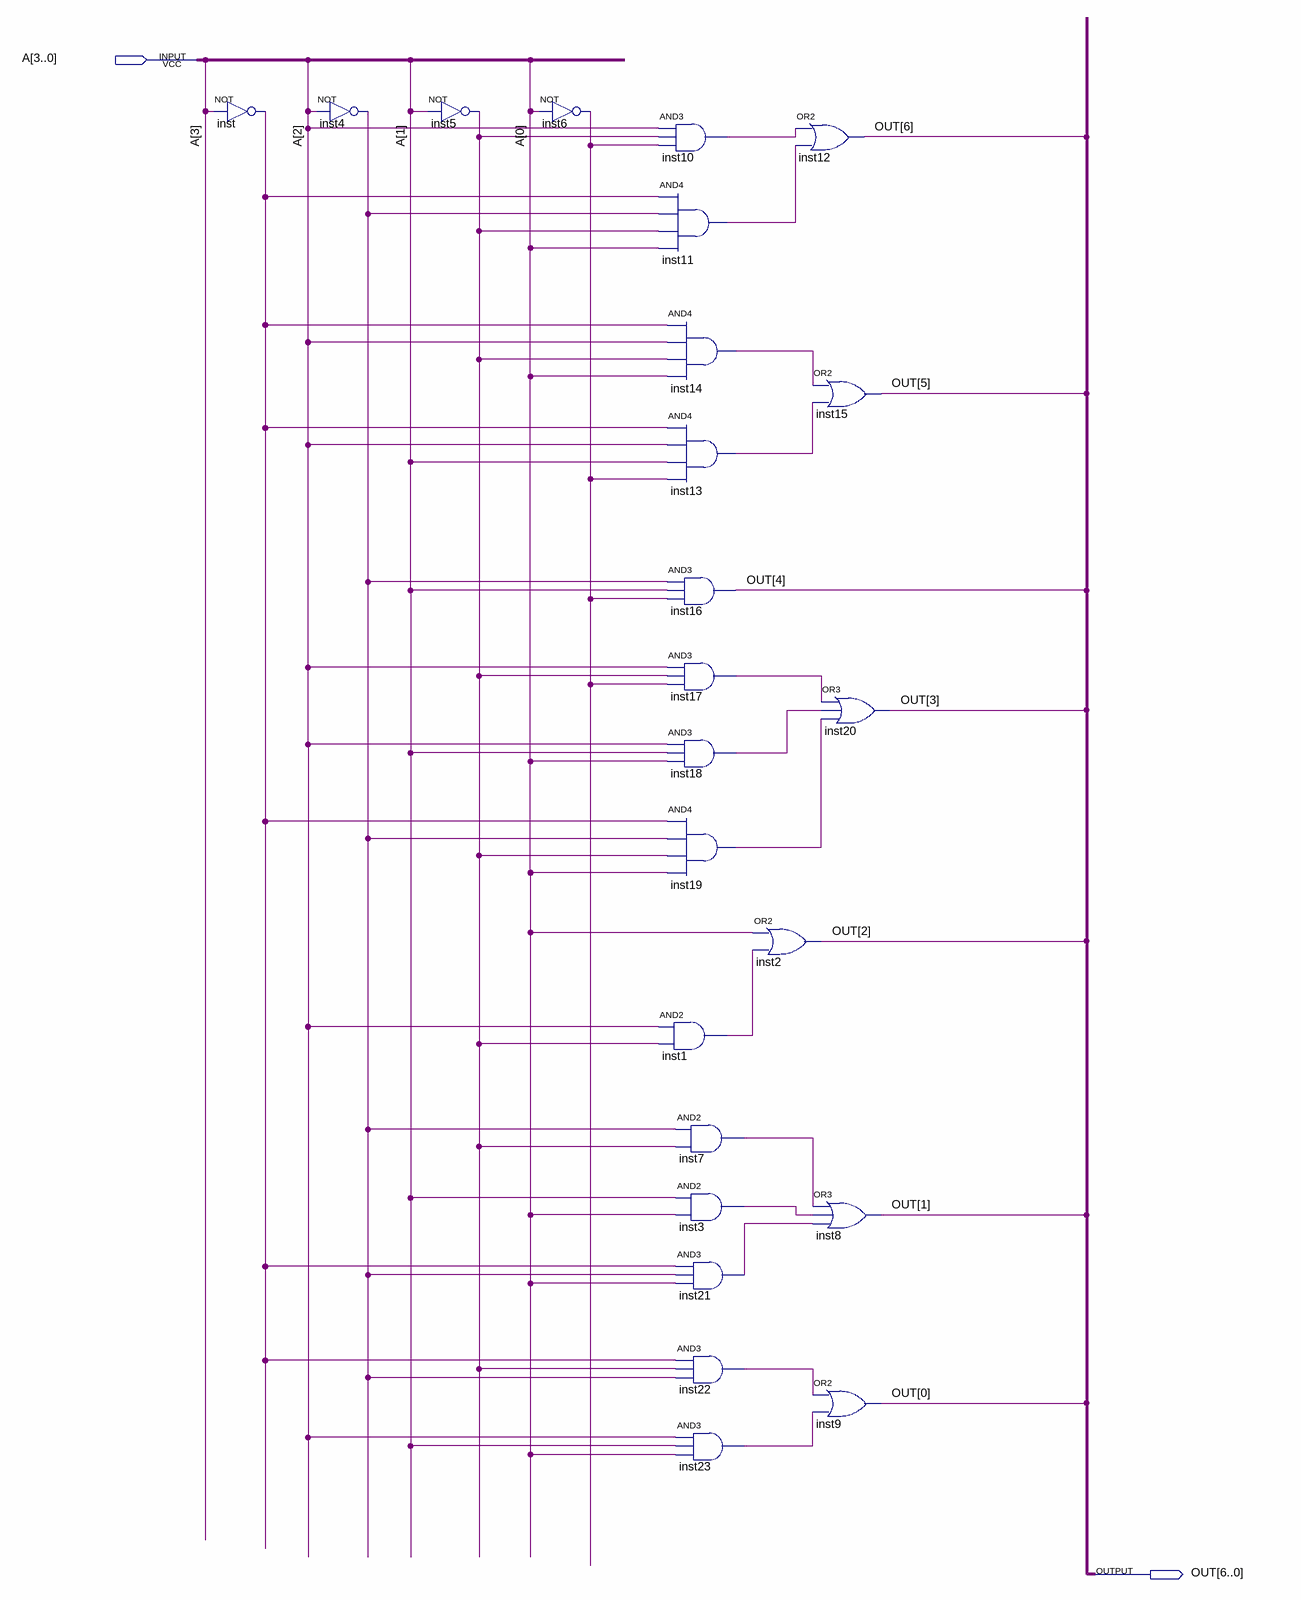
[diagram p0: schematic sheet]
// Quartus schematic display_7_bits.bdf as structural Verilog: 24 symbols, 2 pins
module display_7_bits (
  input  [3:0] A,
  output [6:0] OUT
);

  wire inst1_out, inst3_out, inst4_out, inst5_out, inst6_out, inst7_out, inst10_out, inst11_out, inst13_out,
       inst14_out, inst17_out, inst18_out, inst19_out, inst21_out, inst22_out, inst23_out, inst_out;

  not inst (inst_out, A[3]);
  not inst4 (inst4_out, A[2]);
  not inst5 (inst5_out, A[1]);
  not inst6 (inst6_out, A[0]);
  and inst10 (inst10_out, A[2], inst5_out, inst6_out);
  and inst11 (inst11_out, inst_out, inst4_out, inst5_out, A[0]);
  and inst14 (inst14_out, inst_out, A[2], inst5_out, A[0]);
  and inst13 (inst13_out, inst_out, A[2], A[1], inst6_out);
  and inst16 (OUT[4], inst4_out, A[1], inst6_out);
  and inst17 (inst17_out, A[2], inst5_out, inst6_out);
  and inst18 (inst18_out, A[2], A[1], A[0]);
  and inst19 (inst19_out, inst_out, inst4_out, inst5_out, A[0]);
  and inst1 (inst1_out, A[2], inst5_out);
  and inst7 (inst7_out, inst4_out, inst5_out);
  and inst3 (inst3_out, A[1], A[0]);
  and inst21 (inst21_out, inst_out, inst4_out, A[0]);
  and inst22 (inst22_out, inst_out, inst5_out, inst4_out);
  and inst23 (inst23_out, A[2], A[1], A[0]);
  or inst2 (OUT[2], A[0], inst1_out);
  or inst12 (OUT[6], inst10_out, inst11_out);
  or inst15 (OUT[5], inst14_out, inst13_out);
  or inst20 (OUT[3], inst17_out, inst18_out, inst19_out);
  or inst8 (OUT[1], inst7_out, inst3_out, inst21_out);
  or inst9 (OUT[0], inst22_out, inst23_out);
endmodule
